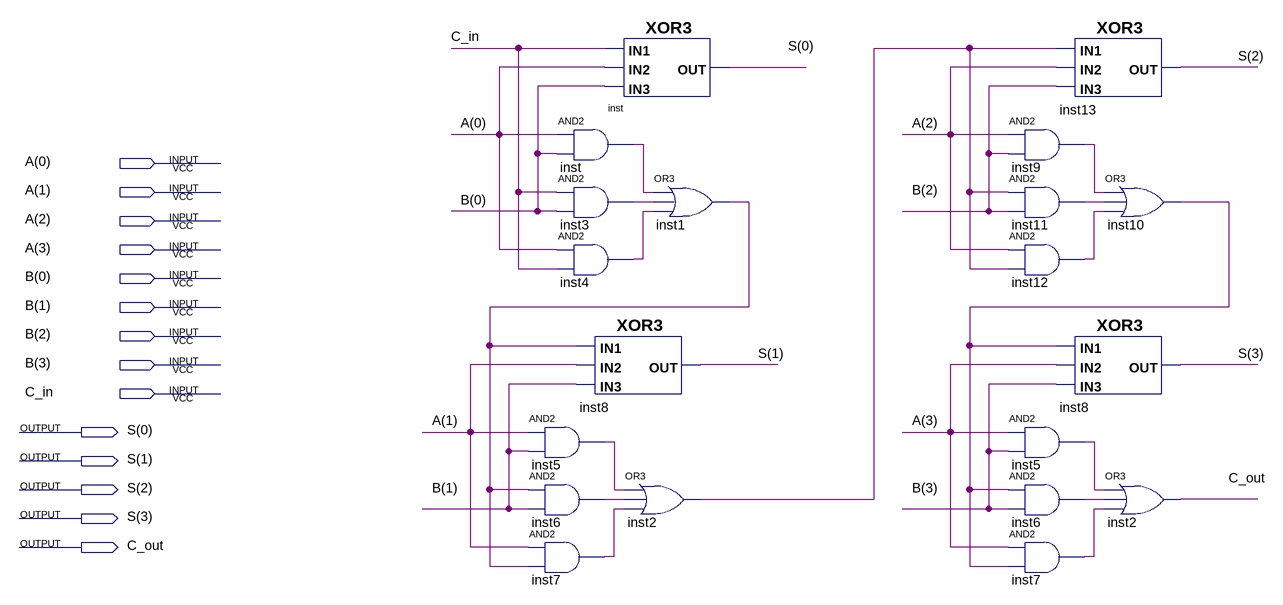
[diagram p0: schematic sheet]
// Quartus schematic sumadorCompleto(4bits).bdf as structural Verilog: 20 symbols, 14 pins
module \sumadorCompleto(4bits)  (
  input  \A(0) ,
  input  \A(1) ,
  input  \A(2) ,
  input  \A(3) ,
  input  \B(0) ,
  input  \B(1) ,
  input  \B(2) ,
  input  \B(3) ,
  input  C_in,
  output \S(0) ,
  output \S(1) ,
  output \S(2) ,
  output \S(3) ,
  output C_out
);

  wire inst1_out, inst2_out, inst3_out, inst4_out, inst5_out, inst5_out_2, inst6_out, inst6_out_2, inst7_out,
       inst7_out_2, inst9_out, inst10_out, inst11_out, inst12_out, inst_out;

  and inst (inst_out, \A(0) , \B(0) );
  and inst3 (inst3_out, C_in, \B(0) );
  and inst4 (inst4_out, \A(0) , C_in);
  XOR3 inst8 (.IN3(\B(1) ), .IN1(inst1_out), .IN2(\A(1) ), .OUT(\S(1) ));
  and inst5 (inst5_out, \A(1) , \B(1) );
  and inst6 (inst6_out, inst1_out, \B(1) );
  and inst7 (inst7_out, \A(1) , inst1_out);
  XOR3 inst_dup2 (.IN3(\B(0) ), .IN1(C_in), .IN2(\A(0) ), .OUT(\S(0) ));
  or inst1 (inst1_out, inst_out, inst3_out, inst4_out);
  or inst2 (inst2_out, inst5_out, inst6_out, inst7_out);
  XOR3 inst13 (.IN3(\B(2) ), .IN1(inst2_out), .IN2(\A(2) ), .OUT(\S(2) ));
  and inst9 (inst9_out, \A(2) , \B(2) );
  and inst11 (inst11_out, inst2_out, \B(2) );
  and inst12 (inst12_out, \A(2) , inst2_out);
  XOR3 inst8_dup2 (.IN3(\B(3) ), .IN1(inst10_out), .IN2(\A(3) ), .OUT(\S(3) ));
  and inst5_dup2 (inst5_out_2, \A(3) , \B(3) );
  and inst6_dup2 (inst6_out_2, inst10_out, \B(3) );
  and inst7_dup2 (inst7_out_2, \A(3) , inst10_out);
  or inst10 (inst10_out, inst9_out, inst11_out, inst12_out);
  or inst2_dup2 (C_out, inst5_out_2, inst6_out_2, inst7_out_2);
endmodule
